# EAGLE design dev style cell rev0.1 (EAGLE 8.4.3)

## Sheet 1 of 3
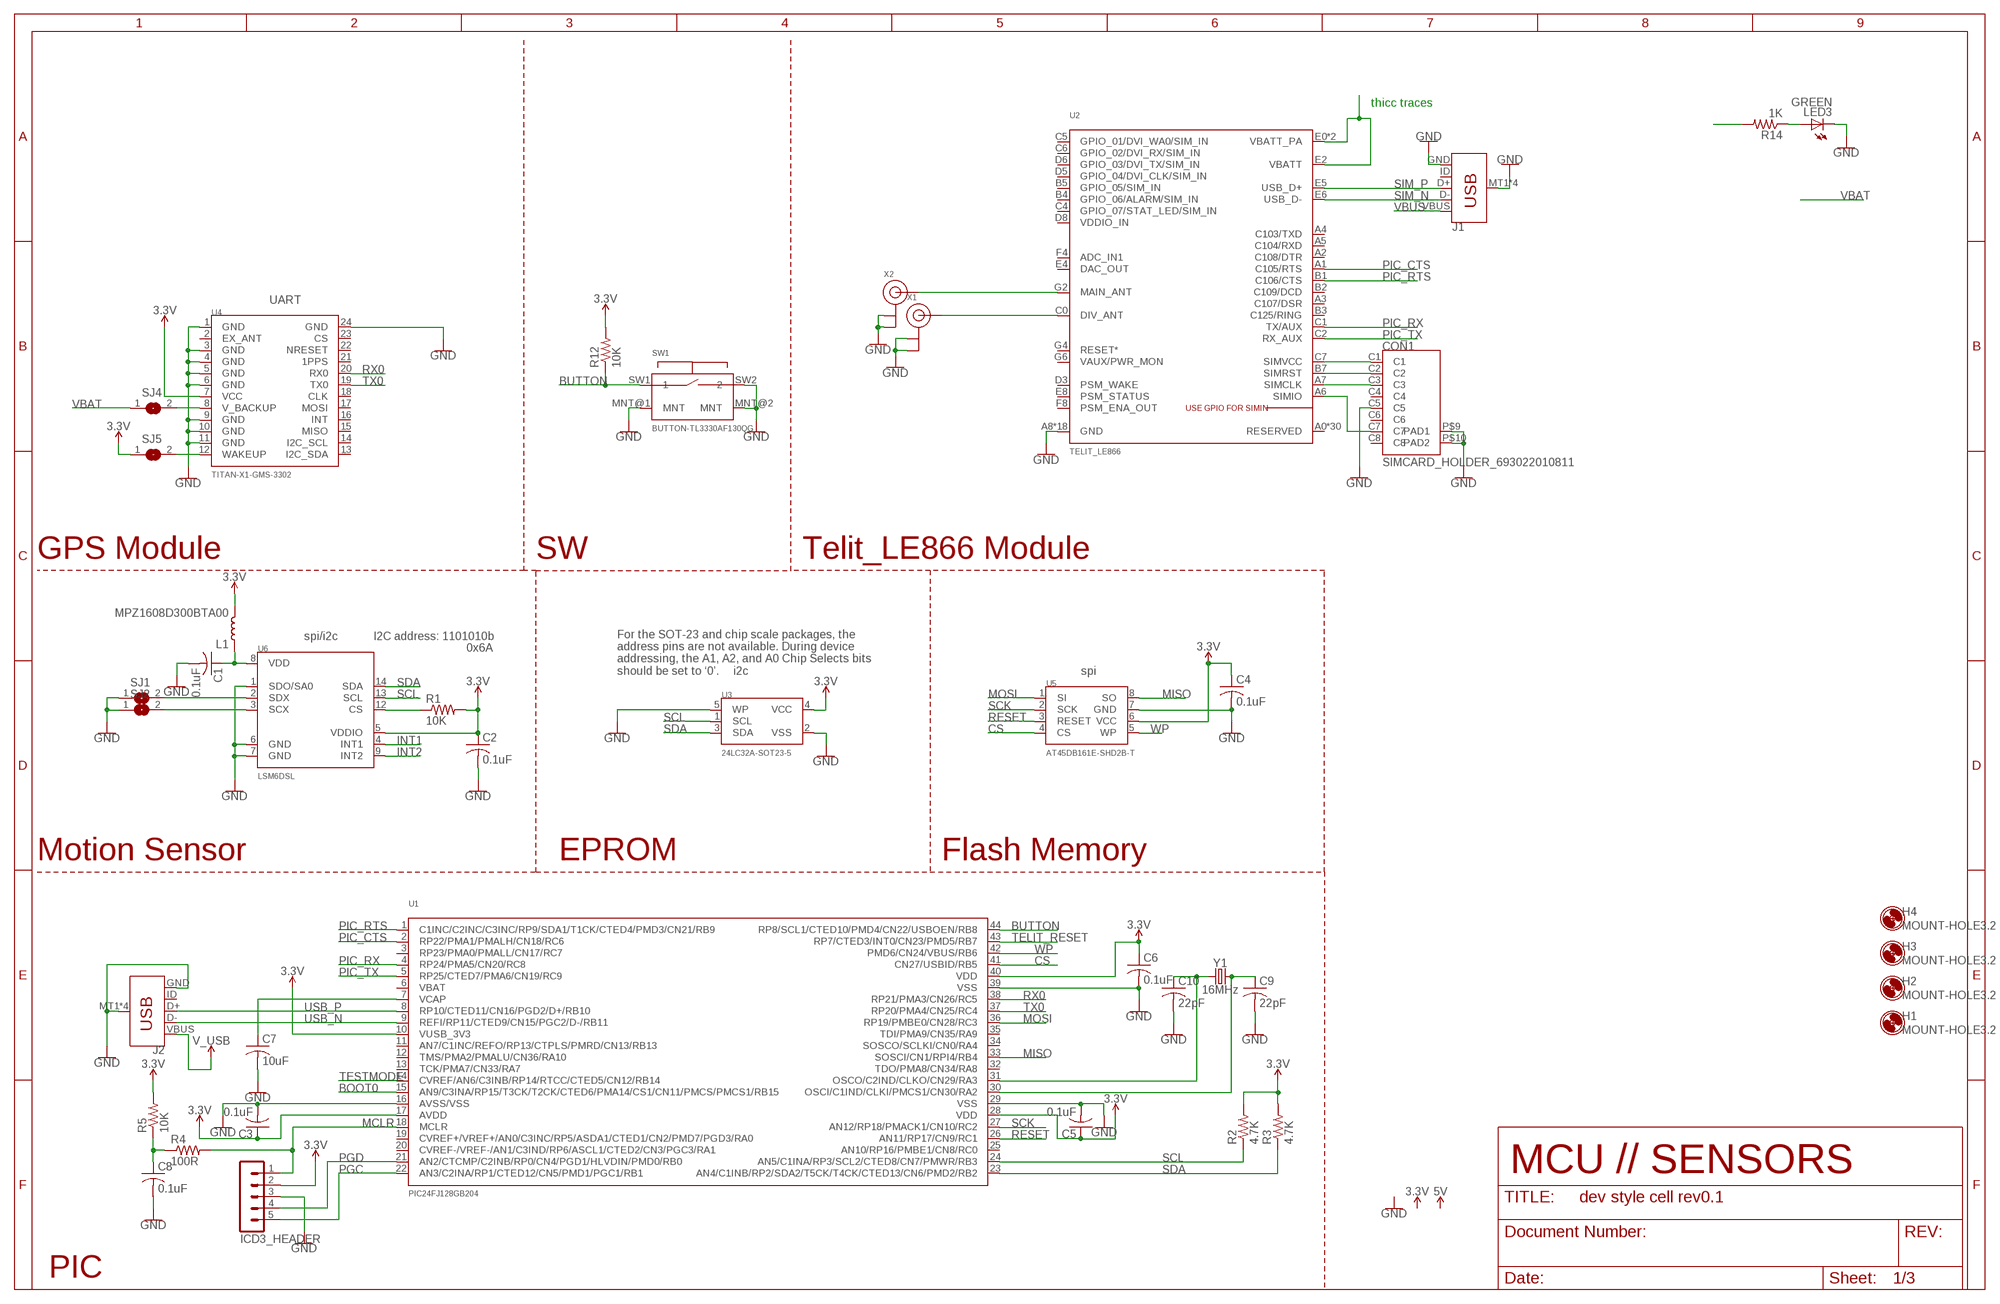
[diagram p0: schematic, sheet 1, part 1 of 2]
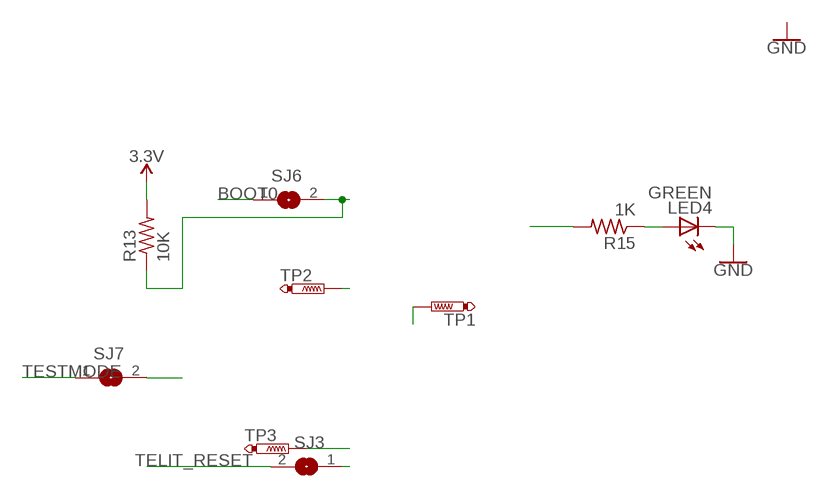
[diagram p1: schematic, sheet 1, part 2 of 2]

### Parts
C1  0.1uF  C-USC0402  [C0402]
C2  0.1uF  C-USC0402  [C0402]
C3  0.1uF  C-USC0402  [C0402]
C4  0.1uF  C-USC0402  [C0402]
C5  0.1uF  C-USC0402  [C0402]
C6  0.1uF  C-USC0402  [C0402]
C7  10uF  C-USC0603  [C0603]
C8  0.1uF  C-USC0402  [C0402]
C9  22pF  C-USC0402  [C0402]
C10  22pF  C-USC0402  [C0402]
CON1  SIMCARD_HOLDER_693022010811  [SIMCARD_HOLDER_693022010811]
H1  MOUNT-HOLE3.2  [3,2]
H2  MOUNT-HOLE3.2  [3,2]
H3  MOUNT-HOLE3.2  [3,2]
H4  MOUNT-HOLE3.2  [3,2]
ICD3_HEADER  MA05-1  [MA05-1]
J1  USB_MICRO-B_SMT  [USB-MICROB]
J2  USB_MICRO-B_SMT  [USB-MICROB]
L1  MPZ1608D300BTA00  INDUCTOR-0402-3.9NH  [0402]
LED3  GREEN  LEDCHIP-LED0603  [CHIP-LED0603]
LED4  GREEN  LEDCHIP-LED0603  [CHIP-LED0603]
R1  10K  R-US_R0402  [R0402]
R2  4.7K  R-US_R0402  [R0402]
R3  4.7K  R-US_R0402  [R0402]
R4  100R  R-US_R0402  [R0402]
R5  10K  R-US_R0402  [R0402]
R12  10K  R-US_R0402  [R0402]
R13  10K  R-US_R0402  [R0402]
R14  1K  R-US_R0402  [R0402]
R15  1K  R-US_R0402  [R0402]
SJ1  SJ  [SJ]
SJ2  SJ  [SJ]
SJ3  SJ  [SJ]
SJ4  SJ  [SJ]
SJ5  SJ  [SJ]
SJ6  SJ  [SJ]
SJ7  SJ  [SJ]
SW1  BUTTON-TL3330AF130QG  [BUTTON-TL3330AF130QG]
TP1  PTR1PAD1-17  [P1-17]
TP2  PTR1PAD1-17  [P1-17]
TP3  PTR1PAD1-17  [P1-17]
U1  PIC24FJ128GB204  [PIC24FJ128GB204]
U2  TELIT_LE866  [TELIT_LE866]
U3  24LC32A-SOT23-5  [24LC32A-SOT23-5]
U4  TITAN-X1-GMS-3302  [TITAN-X1-GMS-3302]
U5  AT45DB161E-SHD2B-T  [AT45DB161E-SHD2B-T]
U6  LSM6DSL  [LSM6DSL]
U$1  FIDUCIAL  [FIDUCIAL_1MM]
U$2  FIDUCIAL  [FIDUCIAL_1MM]
U$3  FIDUCIAL  [FIDUCIAL_1MM]
U$4  FIDUCIAL  [FIDUCIAL_1MM]
X1  ANTENNA_U.FL  [U.FL]
X2  ANTENNA_U.FL  [U.FL]
Y1  16MHz  CRYSTAL-16MHZSMD-5X3.2  [CRYSTAL-SMD-5X3.2-4PAD]

### Nets
3.3V: C2.1 C3.1 C4.1 C5.1 C6.1 ICD3_HEADER.2 L1.2 R1.2 R2.2 R3.2 R5.2 R12.2 R13.2 SJ5.1 U1.10(VUSB_3V3) U1.17(AVDD) U1.28(VDD) U1.40(VDD) U3.4(VCC) U4.7(VCC) U5.6(VCC) U6.5(VDDIO) ; also sheet 2
BOOT0: SJ6.1 U1.15(AN9/C3INA/RP15/T3CK/T2CK/CTED6/PMA14/CS1/CN11/PMCS/PMCS1/RB15)
BUTTON: R12.1 SW1.SW1 U1.44(RP8/SCL1/CTED10/PMD4/CN22/USBOEN/RB8)
CS: U1.41(CN27/USBID/RB5) U5.4(CS)
DIV_ANT: U2.C0(DIV_ANT)
GND: C1.2 C2.2 C3.2 C4.2 C5.2 C6.2 C7.2 C8.2 C9.2 C10.2 CON1.C5 CON1.P$9(PAD1) CON1.P$10(PAD2) ICD3_HEADER.3 J1.GND J1.MT1(SHIELD) J1.MT2(SHIELD) J1.P$1(SHIELD) J1.P$2(SHIELD) J2.GND J2.MT1(SHIELD) J2.MT2(SHIELD) J2.P$1(SHIELD) J2.P$2(SHIELD) LED3.C LED4.C SJ1.1 SJ2.1 SW1.MNT@1(MNT) SW1.MNT@2(MNT) SW1.SW2 U1.16(AVSS/VSS) U1.29(VSS) U1.39(VSS) U2.A8(GND) U2.A11(GND) U2.B0(GND) U2.C3(GND) U2.D0(GND) U2.D1(GND) U2.D2(GND) U2.E3(GND) U2.F0(GND) U2.F1(GND) U2.F2(GND) U2.F3(GND) U2.F6(GND) U2.G0(GND) U2.G1(GND) U2.G3(GND) U2.G8(GND) U2.G11(GND) U3.2(VSS) U3.5(WP) U4.1(GND) U4.3(GND) U4.4(GND) U4.5(GND) U4.6(GND) U4.9(GND) U4.10(GND) U4.11(GND) U4.24(GND) U5.7(GND) U6.1(SDO/SA0) U6.6(GND) U6.7(GND) X1.1(GND) X1.2(GND) X2.1(GND) X2.2(GND) ; also sheet 2
INT1: U6.4(INT1)
INT2: U6.9(INT2)
MAIN_ANT: U2.G2(MAIN_ANT) X2.3(SIGNAL)
MCLR: ICD3_HEADER.1 R4.2 U1.18(MCLR)
MISO: U1.33(SOSCI/CN1/RPI4/RB4) U5.8(SO)
MOSI: U1.36(RP19/PMBE0/CN28/RC3) U5.1(SI)
N$1: SJ1.2 U6.2(SDX)
N$2: SJ2.2 U6.3(SCX)
N$3: R1.1 U6.12(CS)
N$4: SJ4.2 U4.8(V_BACKUP)
N$5: C1.1 L1.1 U6.8(VDD)
N$6: C8.1 R4.1 R5.1
N$7: C9.1 U1.30(OSCI/C1IND/CLKI/PMCS1/CN30/RA2) Y1.3
N$8: C10.1 U1.31(OSCO/C2IND/CLKO/CN29/RA3) Y1.1
N$9: C7.1 U1.7(VCAP)
N$11: SJ7.2
N$12: U2.E0(VBATT_PA) U2.E1(VBATT_PA) U2.E2(VBATT)
N$18: R14.2
N$21: X1.3(SIGNAL)
N$22: R13.1 SJ6.2
N$23: CON1.C1 U2.C7(SIMVCC)
N$25: CON1.C2 U2.B7(SIMRST)
N$26: CON1.C3 U2.A7(SIMCLK)
N$27: CON1.C7 U2.A6(SIMIO)
N$28: LED3.A R14.1
N$30: LED4.A R15.1
N$31: R15.2
N$36: TP3.TP
N$42: SJ3.1
N$47: TP1.TP
N$48: TP2.TP
PGC: ICD3_HEADER.5 U1.22(AN3/C2INA/RP1/CTED12/CN5/PMD1/PGC1/RB1)
PGD: ICD3_HEADER.4 U1.21(AN2/CTCMP/C2INB/RP0/CN4/PGD1/HLVDIN/PMD0/RB0)
PIC_CTS: U1.2(RP22/PMA1/PMALH/CN18/RC6) U2.A1(C105/RTS)
PIC_RTS: U1.1(C1INC/C2INC/C3INC/RP9/SDA1/T1CK/CTED4/PMD3/CN21/RB9) U2.B1(C106/CTS)
PIC_RX: U1.4(RP24/PMA5/CN20/RC8) U2.C1(TX/AUX)
PIC_TX: U1.5(RP25/CTED7/PMA6/CN19/RC9) U2.C2(RX_AUX)
RESET: U1.26(AN11/RP17/CN9/RC1) U5.3(RESET)
RX0: U1.38(RP21/PMA3/CN26/RC5) U4.20(RX0)
SCK: U1.27(AN12/RP18/PMACK1/CN10/RC2) U5.2(SCK)
SCL: R2.1 U1.24(AN5/C1INA/RP3/SCL2/CTED8/CN7/PMWR/RB3) U3.1(SCL) U6.13(SCL)
SDA: R3.1 U1.23(AN4/C1INB/RP2/SDA2/T5CK/T4CK/CTED13/CN6/PMD2/RB2) U3.3(SDA) U6.14(SDA)
SIM_N: J1.D- U2.E6(USB_D-)
SIM_P: J1.D+ U2.E5(USB_D+)
TELIT_RESET: SJ3.2 U1.43(RP7/CTED3/INT0/CN23/PMD5/RB7)
TELIT_WAKEUP: SJ5.2 U4.12(WAKEUP)
TESTMODE: SJ7.1 U1.14(CVREF/AN6/C3INB/RP14/RTCC/CTED5/CN12/RB14)
TX0: U1.37(RP20/PMA4/CN25/RC4) U4.19(TX0)
USB_N: J2.D- U1.9(REFI/RP11/CTED9/CN15/PGC2/D-/RB11)
USB_P: J2.D+ U1.8(RP10/CTED11/CN16/PGD2/D+/RB10)
V_USB: J2.VBUS ; also sheet 2
VBAT: SJ4.1 ; also sheet 2
VBUS: J1.VBUS
WP: U1.42(PMD6/CN24/VBUS/RB6) U5.5(WP)
Unconnected: CON1.C4 CON1.C6 CON1.C8 J1.ID J2.ID U1.3(RP23/PMA0/PMALL/CN17/RC7) U1.6(VBAT) U1.11(AN7/C1INC/REFO/RP13/CTPLS/PMRD/CN13/RB13) U1.12(TMS/PMA2/PMALU/CN36/RA10) U1.13(TCK/PMA7/CN33/RA7) U1.19(CVREF+/VREF+/AN0/C3INC/RP5/ASDA1/CTED1/CN2/PMD7/PGD3/RA0) U1.20(CVREF-/VREF-/AN1/C3IND/RP6/ASCL1/CTED2/CN3/PGC3/RA1) U1.25(AN10/RP16/PMBE1/CN8/RC0) U1.32(TDO/PMA8/CN34/RA8) U1.34(SOSCO/SCLKI/CN0/RA4) U1.35(TDI/PMA9/CN35/RA9) U2.A0(RESERVED) U2.A2(C108/DTR) U2.A3(C107/DSR) U2.A4(C103/TXD) U2.A5(C104/RXD) U2.A9(RESERVED) U2.A10(RESERVED) U2.B2(C109/DCD) U2.B3(C125/RING) U2.B4(GPIO_06/ALARM/SIM_IN) U2.B5(GPIO_05/SIM_IN) U2.B6(RESERVED) U2.B8(RESERVED) U2.B9(RESERVED) U2.B10(RESERVED) U2.B11(RESERVED) U2.C4(GPIO_07/STAT_LED/SIM_IN) U2.C5(GPIO_01/DVI_WA0/SIM_IN) U2.C6(GPIO_02/DVI_RX/SIM_IN) U2.C8(RESERVED) U2.C9(RESERVED) U2.C10(RESERVED) U2.C11(RESERVED) U2.D3(PSM_WAKE) U2.D4(RESERVED) U2.D5(GPIO_04/DVI_CLK/SIM_IN) U2.D6(GPIO_03/DVI_TX/SIM_IN) U2.D7(RESERVED) U2.D8(VDDIO_IN) U2.D9(RESERVED) U2.D10(RESERVED) U2.D11(RESERVED) U2.E4(DAC_OUT) U2.E7(RESERVED) U2.E8(PSM_STATUS) U2.E9(RESERVED) U2.E10(RESERVED) U2.E11(RESERVED) U2.F4(ADC_IN1) U2.F5(RESERVED) U2.F7(RESERVED) U2.F8(PSM_ENA_OUT) U2.F9(RESERVED) U2.F10(RESERVED) U2.F11(RESERVED) U2.G4(RESET*) U2.G5(RESERVED) U2.G6(VAUX/PWR_MON) U2.G7(RESERVED) U2.G9(RESERVED) U2.G10(RESERVED) U4.2(EX_ANT) U4.13(I2C_SDA) U4.14(I2C_SCL) U4.15(MISO) U4.16(INT) U4.17(MOSI) U4.18(CLK) U4.21(1PPS) U4.22(NRESET) U4.23(CS)

### Notes on the sheet
- thicc traces
- UART
- GPS Module | SW | Telit_LE866 Module
- spi/i2c | I2C address: 1101010b
- 0x6A
- For the SOT-23 and chip scale packages, the
  address pins are not available. During device
  addressing, the A1, A2, and A0 Chip Selects bits
  should be set to ‘0’.
- i2c | spi
- Motion Sensor | EPROM | Flash Memory
- MCU // SENSORS
- PIC

## Sheet 2 of 3
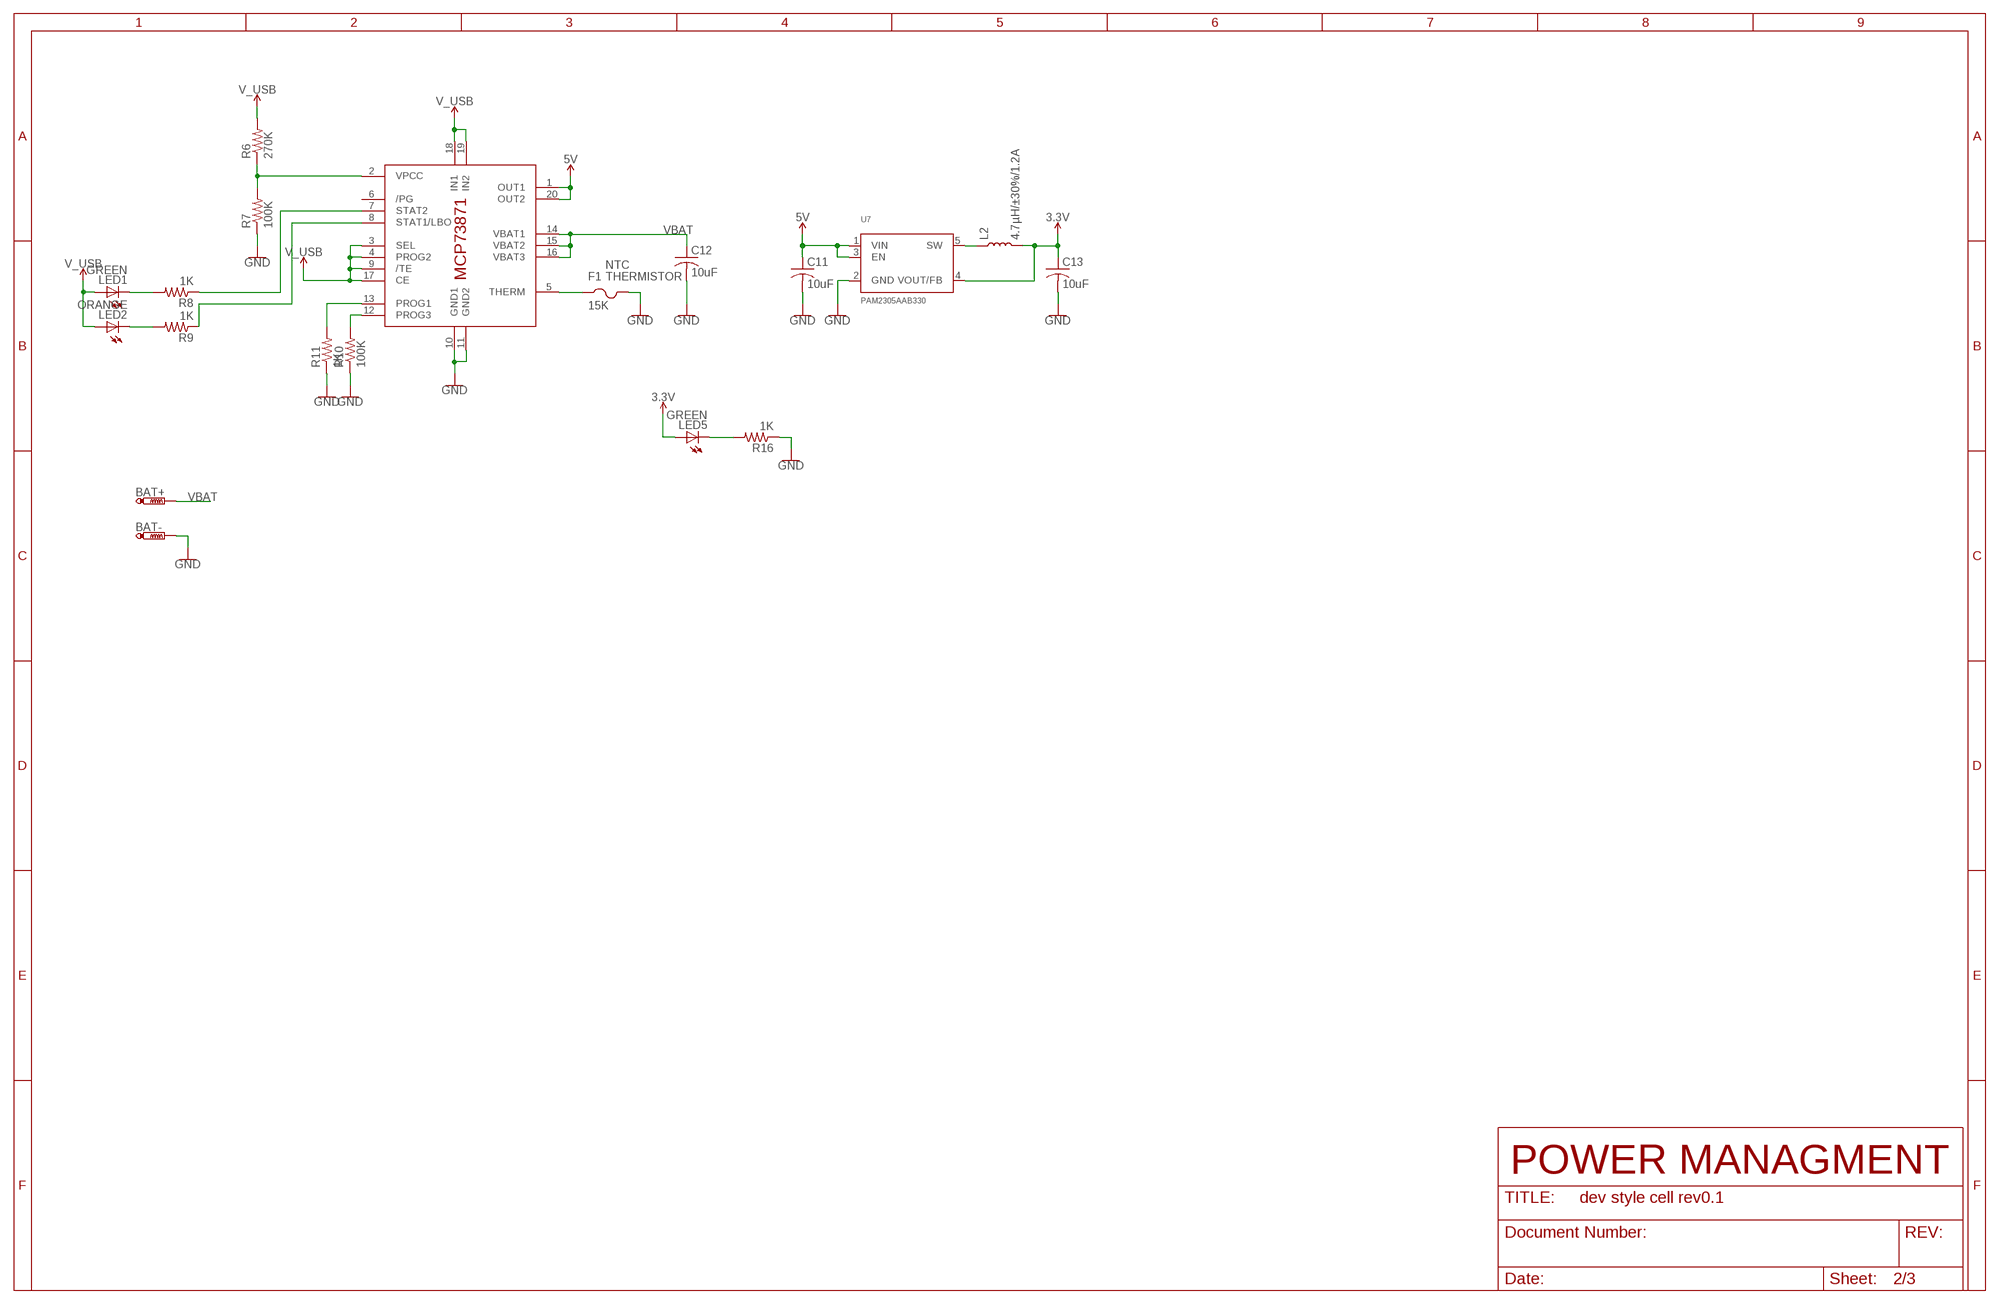
[diagram p2: schematic, sheet 2]

### Parts
BAT+  PTR1B2,54  [B2,54]
BAT-  PTR1B2,54  [B2,54]
C11  10uF  C-USC0805  [C0805]
C12  10uF  C-USC0603  [C0603]
C13  10uF  C-USC0805  [C0805]
F1  15K  PTCFUSE-1206  [R1206]
L2  4.7µH/±30%/1.2A  INDUCTOR-CDRH-4.7UH  [INDUCTOR_4.7UH]
LED1  GREEN  LEDCHIP-LED0603  [CHIP-LED0603]
LED2  ORANGE  LEDCHIP-LED0603  [CHIP-LED0603]
LED5  GREEN  LEDCHIP-LED0603  [CHIP-LED0603]
R6  270K  R-US_R0402  [R0402]
R7  100K  R-US_R0402  [R0402]
R8  1K  R-US_R0402  [R0402]
R9  1K  R-US_R0402  [R0402]
R10  100K  R-US_R0402  [R0402]
R11  1K  R-US_R0402  [R0402]
R16  1K  R-US_R0402  [R0402]
U7  PAM2305AAB330  [PAM2305AAB330]
U8  MCP73871  [QFN20]

### Nets
3.3V: C13.1 L2.P$2 LED5.A U7.4(VOUT/FB) ; also sheet 1
5V: C11.1 U7.1(VIN) U7.3(EN) U8.1(OUT1) U8.20(OUT2)
GND: BAT-.TP C11.2 C12.2 C13.2 F1.2 R7.1 R10.1 R11.1 R16.1 U7.2(GND) U8.10(GND1) U8.11(GND2) ; also sheet 1
N$10: R6.1 R7.2 U8.2(VPCC)
N$13: LED1.C R8.2
N$14: LED2.C R9.2
N$15: R8.1 U8.7(STAT2)
N$16: R9.1 U8.8(STAT1/LBO)
N$17: L2.P$1 U7.5(SW)
N$19: R10.2 U8.12(PROG3)
N$20: R11.2 U8.13(PROG1)
N$24: F1.1 U8.5(THERM)
N$35: LED5.C R16.2
V_USB: LED1.A LED2.A R6.2 U8.3(SEL) U8.4(PROG2) U8.9(/TE) U8.17(CE) U8.18(IN1) U8.19(IN2) ; also sheet 1
VBAT: BAT+.TP C12.1 U8.14(VBAT1) U8.15(VBAT2) U8.16(VBAT3) ; also sheet 1
Unconnected: U8.6(/PG)

### Notes on the sheet
- NTC
- THERMISTOR
- POWER MANAGMENT

## Sheet 3 of 3
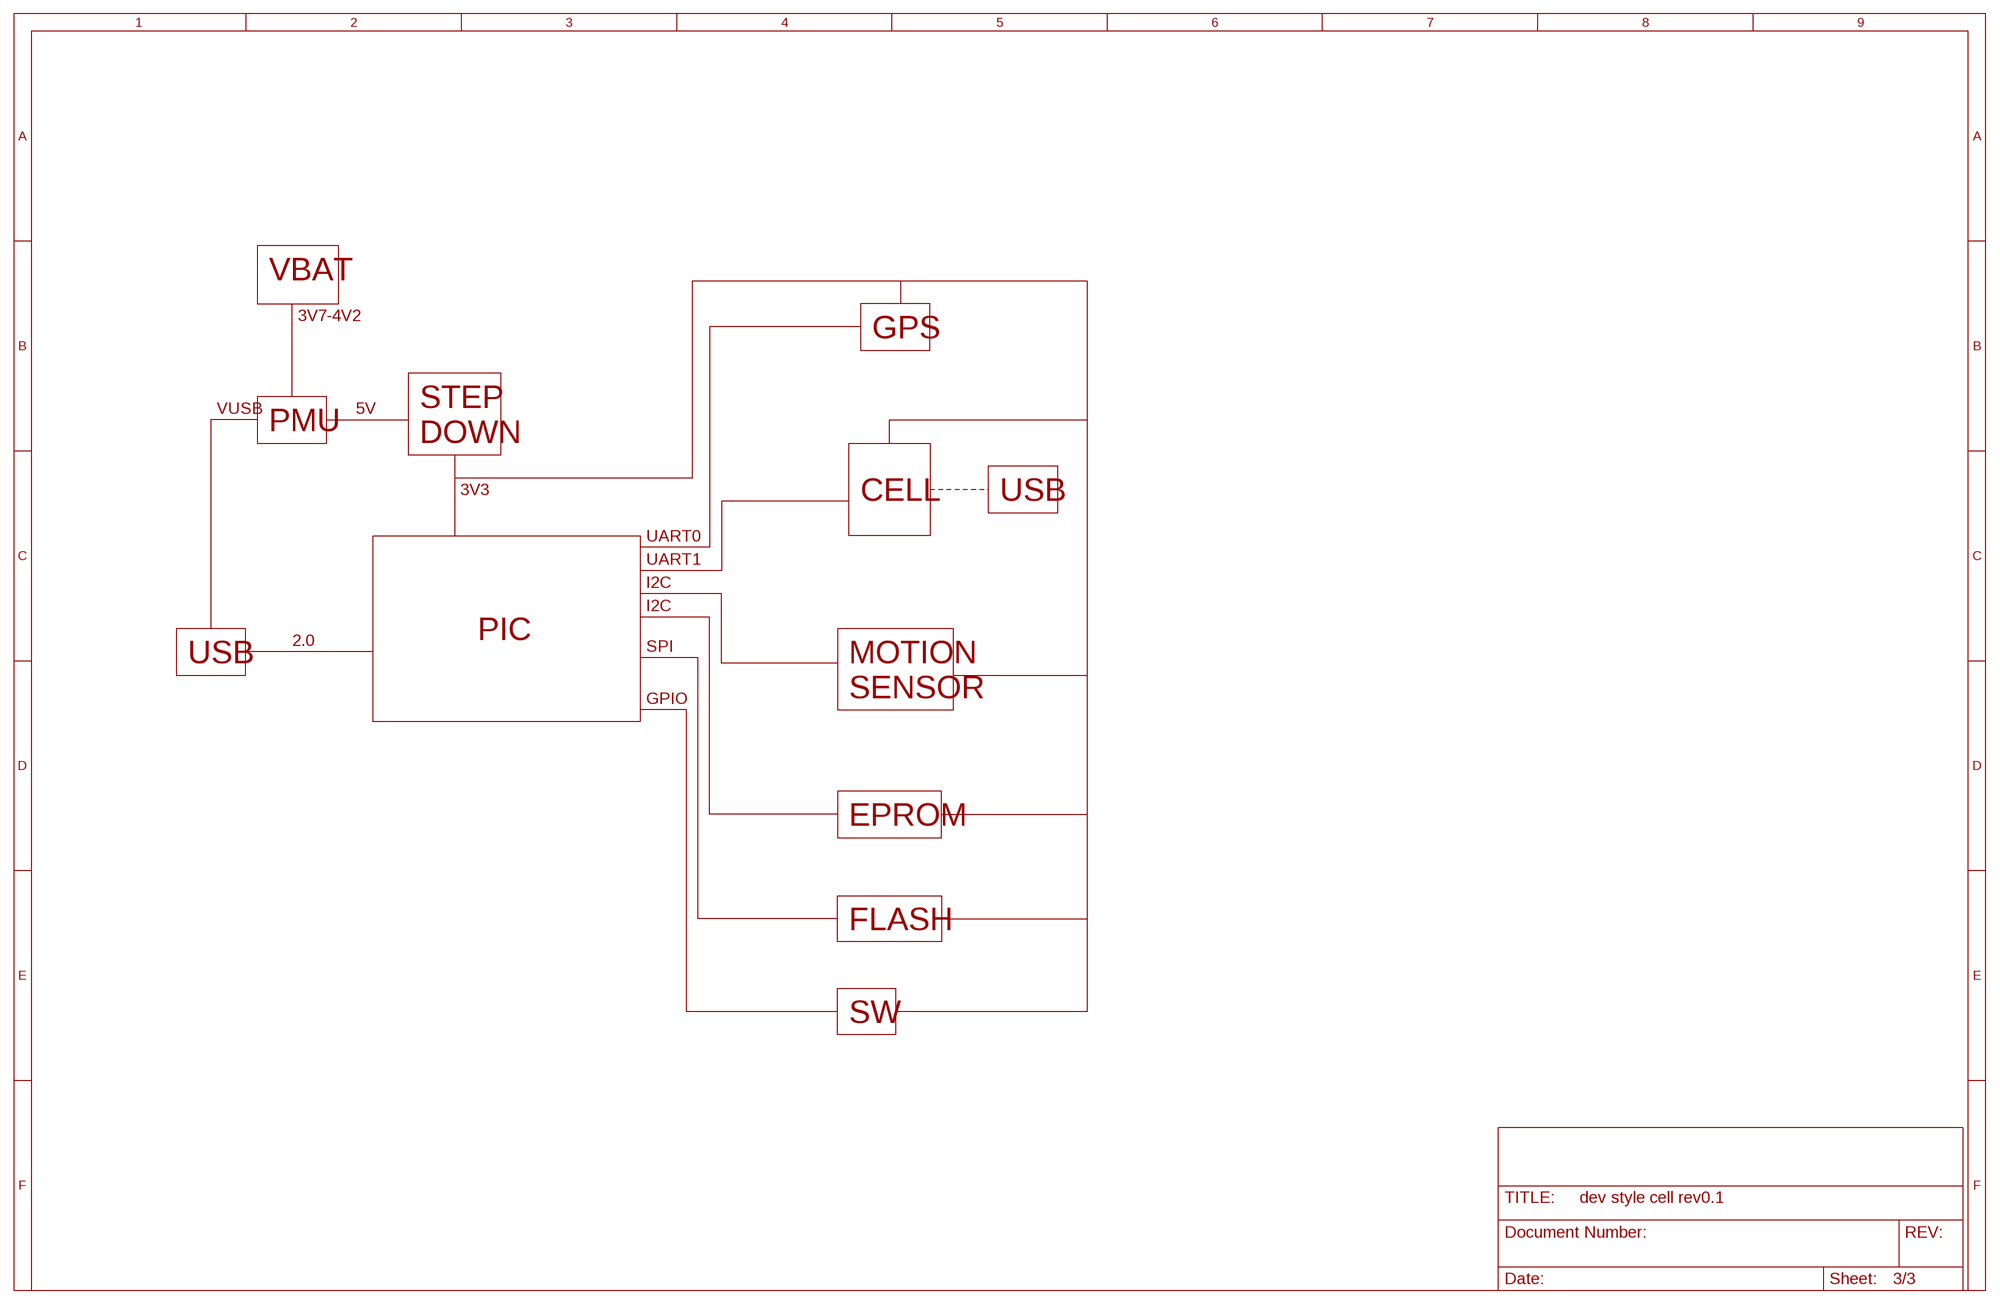
[diagram p3: schematic, sheet 3]

### Notes on the sheet
- VBAT
- 3V7-4V2
- GPS
- VUSB | 5V
- PMU
- STEP
  DOWN
- 3V3
- CELL | USB
- UART0
- UART1
- I2C
- I2C
- PIC
- 2.0
- SPI
- USB
- MOTION 
  SENSOR
- GPIO
- EPROM
- FLASH
- SW

## Library data of the parts
BAT+ BAT- TP1-TP3 = testpad:PTR1: TEST PIN
C1-C13 = resistor:C-US: CAPACITOR, American symbol
CON1 = clackboard_lib:SIMCARD_HOLDER_693022010811
F1 = adafruit:PTCFUSE: PTC fuses, resettable thermistors
H1-H4 = holes:MOUNT-HOLE: MOUNTING HOLE with drill center marker
ICD3_HEADER = con-lstb:MA05-1: PIN HEADER; OC_FARNELL: unknown; OC_NEWARK: unknown
J1 J2 = SparkFun-Connectors:USB_MICRO-B: USB Type Micro-B Connector Male/female and PTH/SMT variants SparkFun Products: SparkFun microB USB Breakout <https://www.sparkfun.com/products/12035> SparkFun USB microB Plug Breakout <https://www.sparkfun.com/products/10031> SparkFun ESP8266 Thing <https://www.sparkfun.com/products/13231>; PROD_ID: CONN-09505; SF_ID: PRT-08533
L1 = SparkFun-Coils:INDUCTOR: Inductors Resist changes in electrical current. Basically a coil of wire. SparkFun Products: SparkFun Load Cell Amplifier - HX711 <https://www.sparkfun.com/products/13879> IOIO-OTG - V2.2 <https://www.sparkfun.com/products/13613>; PROD_ID: NDUC-13457; VALUE: 3.9NH
L2 = SparkFun-Coils:INDUCTOR: Inductors Resist changes in electrical current. Basically a coil of wire. SparkFun Products: SparkFun Load Cell Amplifier - HX711 <https://www.sparkfun.com/products/13879> IOIO-OTG - V2.2 <https://www.sparkfun.com/products/13613>; PROD_ID: NDUC-10146
LED1-LED5 = adafruit:LED: LED OSRAM: - CHIPLED LG R971, LG N971, LY N971, LG Q971, LY Q971, LO R971, LY R971 LH N974, LH R974 LS Q976, LO Q976, LY Q976 LO Q996 - Hyper CHIPLED LW Q18S LB Q993, LB Q99A, LB R99A - SideLED LS A670, LO A670, LY A670, LG A670, LP A670 LB A673, LV A673, LT A673, LW A673 LH A674 LY A675 LS A676, LA A676, LO A676, LY A676, LW A676 LS A679, LY A679, LG A679 - Hyper Micro SIDELED® LS Y876, LA Y876, LO Y876, LY Y876 LT Y87S - SmartLED LW L88C, LW L88S LB L89C, LB L89S, LG L890 LS L89K, LO L89K, LY L89K LS L896, LA L896, LO L896, LY L896 - TOPLED LS T670, LO T670, LY T670, LG T670, LP T670 LSG T670, LSP T670, LSY T670, LOP T670, LYG T670 LG T671, LOG T671, LSG T671 LB T673, LV T673, LT T673, LW T673 LH T674 LS T676, LA T676, LO T676, LY T676, LB T676, LH T676, LSB T676, LW T676 LB T67C, LV T67C, LT T67C, LS T67K, LO T67K, LY T67K, LW E67C LS E67B, LA E67B, LO E67B, LY E67B, LB E67C, LV E67C, LT E67C LW T67C LS T679, LY T679, LG T679 LS T770, LO T770, LY T770, LG T770, LP T770 LB T773, LV T773, LT T773, LW T773 LH T774 LS E675, LA E675, LY E675, LS T675 LS T776, LA T776, LO T776, LY T776, LB T776 LHGB T686 LT T68C, LB T68C - Hyper Mini TOPLED® LB M676 - Mini TOPLED Santana® LG M470 LS M47K, LO M47K, LY M47K Source: http://www.osram.convergy.de/
R1-R16 = resistor:R-US_: RESISTOR, American symbol
SJ1-SJ7 = jumper:SJ: SMD solder JUMPER
SW1 = clackboard_lib:BUTTON-TL3330AF130QG
U1 = clackboard_lib:PIC24FJ128GB204
U2 = clackboard_lib:TELIT_LE866
U3 = clackboard_lib:24LC32A-SOT23-5
U4 = clackboard_lib:TITAN-X1-GMS-3302
U5 = clackboard_lib:AT45DB161E-SHD2B-T
U6 = clackboard_lib:LSM6DSL; SPICEPREFIX: X
U7 = clackboard_lib:PAM2305AAB330
U8 = adafruit:MCP73871
U$1-U$4 = adafruit:FIDUCIAL: For use by pick and place machines to calibrate the vision/machine, 1mm By microbuilder.eu
X1 X2 = adafruit:ANTENNA_U.FL: U.FL Antenna Connector
Y1 = SparkFun-Clocks:CRYSTAL-16MHZ: 16MHz Crystal Digikey Example <http://www.digikey.com/product-search/en?keywords=535-9122-1-ND> Frequency: 16MHz Frequency Stability: ±50ppm Frequency Tolerance: ±20ppm Load Capacitance: 18pF SparkFun Products: Pro Micro -5V/16MHz <https://www.sparkfun.com/products/12640> SparkFun Serial Enabled LCD Kit <https://www.sparkfun.com/products/10097>; PROD_ID: XTAL-08218; SF_ID: COM-00094

## Board
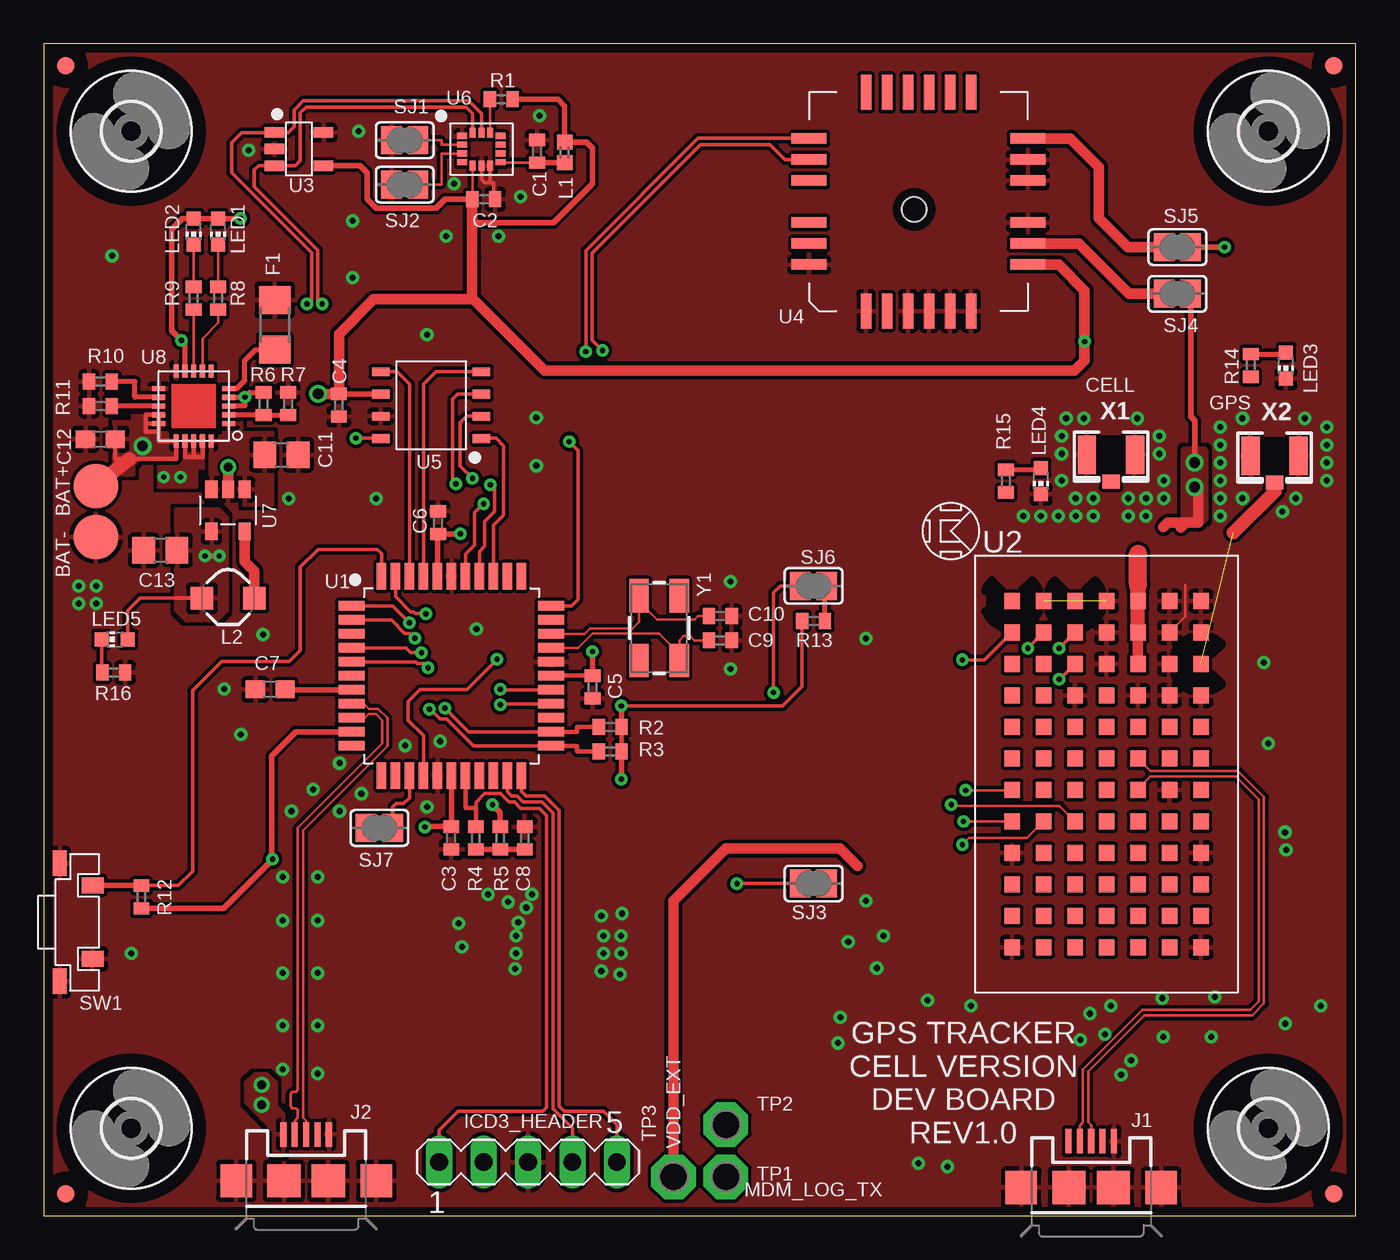
[diagram p4: board, top side]
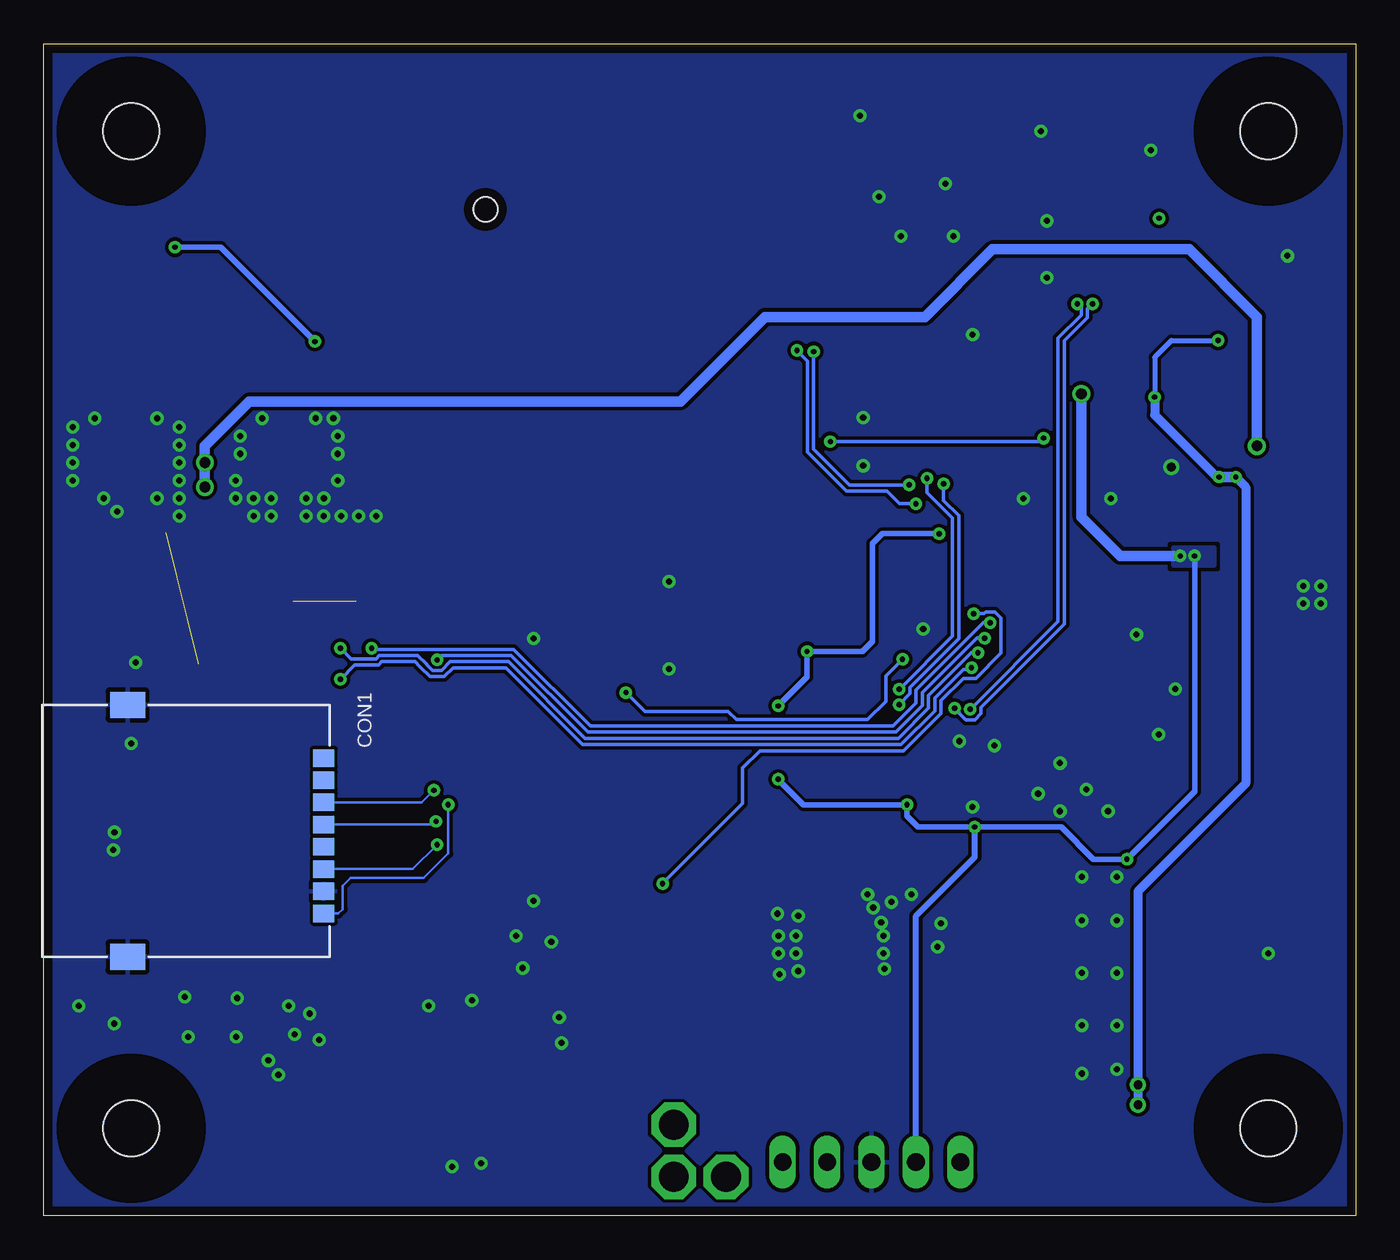
[diagram p5: board, bottom side, seen from below]

Size 75 x 67 mm. Coordinates in mm from the lower left corner, seen from the top.
Outline: 0,0 75,0 75,67 0,67 0,0
Copper layers (1*16): Top 0.035mm / dielectric 1.5mm / Bottom 0.035mm
Design rules "default *": minimum track width 6mil, minimum drill 0.3mm, track to track 6mil, track to pad 6mil, pad to pad 6mil, via to via 6mil, smd to smd 6mil, copper to edge 20mil, drill to drill 6mil, minimum pad ring 10mil, minimum via ring 8mil, stop-mask expansion 4mil, vias tented up to drill 0.35mm, thermal gap 10mil

### Footprints (pad centres in the part's own frame; a part is rotated, then mirrored left to right if it is on the bottom)
B2,54 = smd 2.54 x 2.54: TP 0,0
C0402 = smd 0.7 x 0.9: 1 -0.65,0; 2 0.65,0
C0603 = smd 1.1 x 1: 1 -0.85,0; 2 0.85,0
C0805 = smd 1.3 x 1.5: 1 -0.95,0; 2 0.95,0
SIMCARD_HOLDER_693022010811 = smd 1 x 1.2: C1 -4.72,0; C2 -2.18,0; C3 0.36,0; C4 2.9,0; C5 -3.45,0; C6 -0.91,0; C7 1.63,0; C8 4.17,0 | smd 1.5 x 2: P$9 -7.2,11.2; P$10 7.2,11.2
R1206 = smd 1.6 x 1.803: 1 -1.422,0; 2 1.422,0
3,2 = hole 3.2: 0,0
MA05-1 = drill 1.016 long: 1 -5.08,0; 2 -2.54,0; 3 0,0; 4 2.54,0; 5 5.08,0
USB-MICROB = smd 1.4 x 0.35: D+ -2.65,0; D- -2.65,-0.65; GND -2.65,1.3; ID -2.65,0.65; VBUS -2.65,-1.3 | smd 1.9 x 1.8: MT1 0,-4; MT2 0,4 | smd 1.9 x 1.9: P$1 0,-1.27; P$2 0,1.27
0402 = smd 0.85 x 0.9: 1 -0.58,0; 2 0.58,0
INDUCTOR_4.7UH = smd 1.3 x 1.3: P$1 -1.5,0; P$2 1.5,0
CHIP-LED0603 = smd 0.8 x 0.8: A 0,-0.75; C 0,0.75
R0402 = smd 0.7 x 0.9: 1 -0.65,0; 2 0.65,0
SJ = smd 1.168 x 1.6: 1 -0.762,0; 2 0.762,0
BUTTON-TL3330AF130QG = smd 1.45 x 0.8: MNT@1 -3.375,-1; MNT@2 3.375,-1 | smd 0.9 x 1.27: SW1 -2.1,0.885; SW2 2.1,0.885
P1-17 = drill 1.702 pad 2.54 octagon: TP 0,0
PIC24FJ128GB204 = smd 1.5 x 0.55: 1 -5.7,4; 2 -5.7,3.2; 3 -5.7,2.4; 4 -5.7,1.6; 5 -5.7,0.8; 6 -5.7,0; 7 -5.7,-0.8; 8 -5.7,-1.6; 9 -5.7,-2.4; 10 -5.7,-3.2; 11 -5.7,-4; 23 5.7,-4; 24 5.7,-3.2; 25 5.7,-2.4; 26 5.7,-1.6; 27 5.7,-0.8; 28 5.7,0; 29 5.7,0.8; 30 5.7,1.6; 31 5.7,2.4; 32 5.7,3.2; 33 5.7,4 | smd 0.55 x 1.5: 12 -4,-5.7; 13 -3.2,-5.7; 14 -2.4,-5.7; 15 -1.6,-5.7; 16 -0.8,-5.7; 17 0,-5.7; 18 0.8,-5.7; 19 1.6,-5.7; 20 2.4,-5.7; 21 3.2,-5.7; 22 4,-5.7; 34 4,5.7; 35 3.2,5.7; 36 2.4,5.7; 37 1.6,5.7; 38 0.8,5.7; 39 0,5.7; 40 -0.8,5.7; 41 -1.6,5.7; 42 -2.4,5.7; 43 -3.2,5.7; 44 -4,5.7
TELIT_LE866 = smd 0.9 x 0.9: A0 -5.4,9.9; A1 -5.4,8.1; A2 -5.4,6.3; A3 -5.4,4.5; A4 -5.4,2.7; A5 -5.4,0.9; A6 -5.4,-0.9; A7 -5.4,-2.7; A8 -5.4,-4.5; A9 -5.4,-6.3; A10 -5.4,-8.1; A11 -5.4,-9.9; B0 -3.6,9.9; B1 -3.6,8.1; B2 -3.6,6.3; B3 -3.6,4.5; B4 -3.6,2.7; B5 -3.6,0.9; B6 -3.6,-0.9; B7 -3.6,-2.7; B8 -3.6,-4.5; B9 -3.6,-6.3; B10 -3.6,-8.1; B11 -3.6,-9.9; C0 -1.8,9.9; C1 -1.8,8.1; C2 -1.8,6.3; C3 -1.8,4.5; C4 -1.8,2.7; C5 -1.8,0.9; C6 -1.8,-0.9; C7 -1.8,-2.7; C8 -1.8,-4.5; C9 -1.8,-6.3; C10 -1.8,-8.1; C11 -1.8,-9.9; D0 0,9.9; D1 0,8.1; D2 0,6.3; D3 0,4.5; D4 0,2.7; D5 0,0.9; D6 0,-0.9; D7 0,-2.7; D8 0,-4.5; D9 0,-6.3; D10 0,-8.1; D11 0,-9.9; E0 1.8,9.9; E1 1.8,8.1; E2 1.8,6.3; E3 1.8,4.5; E4 1.8,2.7; E5 1.8,0.9; E6 1.8,-0.9; E7 1.8,-2.7; E8 1.8,-4.5; E9 1.8,-6.3; E10 1.8,-8.1; E11 1.8,-9.9; F0 3.6,9.9; F1 3.6,8.1; F2 3.6,6.3; F3 3.6,4.5; F4 3.6,2.7; F5 3.6,0.9; F6 3.6,-0.9; F7 3.6,-2.7; F8 3.6,-4.5; F9 3.6,-6.3; F10 3.6,-8.1; F11 3.6,-9.9; G0 5.4,9.9; G1 5.4,8.1; G2 5.4,6.3; G3 5.4,4.5; G4 5.4,2.7; G5 5.4,0.9; G6 5.4,-0.9; G7 5.4,-2.7; G8 5.4,-4.5; G9 5.4,-6.3; G10 5.4,-8.1; G11 5.4,-9.9
24LC32A-SOT23-5 = smd 0.6 x 1.1: 1 -0.95,-1.4; 2 0,-1.4; 3 0.95,-1.4; 4 0.95,1.4; 5 -0.95,1.4
TITAN-X1-GMS-3302 = smd 2 x 0.6: 1 -6.25,3; 2 -6.25,1.8; 3 -6.25,0.6; 4 -6.25,-0.6; 5 -6.25,-1.8; 6 -6.25,-3; 13 6.25,-3; 14 6.25,-1.8; 15 6.25,-0.6; 16 6.25,0.6; 17 6.25,1.8; 18 6.25,3 | smd 0.6 x 2: 7 -3.6,-6.25; 8 -2.4,-6.25; 9 -1.2,-6.25; 10 1.2,-6.25; 11 2.4,-6.25; 12 3.6,-6.25; 19 3.6,6.25; 20 2.4,6.25; 21 1.2,6.25; 22 -1.2,6.25; 23 -2.4,6.25; 24 -3.6,6.25 | hole 1.4: -0.45,0.25
AT45DB161E-SHD2B-T = smd 0.5 x 1: 1 -1.905,-2.875; 2 -0.635,-2.875; 3 0.635,-2.875; 4 1.905,-2.875; 5 1.905,2.875; 6 0.635,2.875; 7 -0.635,2.875; 8 -1.905,2.875
LSM6DSL = smd 0.575 x 0.35: 1 -1.1,0.75; 2 -1.1,0.25; 3 -1.1,-0.25; 4 -1.1,-0.75; 8 1.1,-0.75; 9 1.1,-0.25; 10 1.1,0.25; 11 1.1,0.75 | smd 0.35 x 0.575: 5 -0.5,-0.95; 6 0,-0.95; 7 0.5,-0.95; 12 0.5,0.95; 13 0,0.95; 14 -0.5,0.95
PAM2305AAB330 = smd 0.7 x 1: 1 -0.95,-1.2; 2 0,-1.2; 3 0.95,-1.2; 4 0.95,1.2; 5 -0.95,1.2
QFN20 = smd 0.75 x 0.3: 1 -2,1; 2 -2,0.5; 3 -2,0; 4 -2,-0.5; 5 -2,-1; 11 2,-1; 12 2,-0.5; 13 2,0; 14 2,0.5; 15 2,1 | smd 0.3 x 0.75: 6 -1,-2; 7 -0.5,-2; 8 0,-2; 9 0.5,-2; 10 1,-2; 16 1,2; 17 0.5,2; 18 0,2; 19 -0.5,2; 20 -1,2
FIDUCIAL_1MM = smd 1 x 1: 1 0,0
U.FL = smd 2.2 x 1.05: 1 0,1.375; 2 0,-1.375 | smd 0.8 x 1: 3 1.525,0
CRYSTAL-SMD-5X3.2-4PAD = smd 1.9 x 1.1: 1 -1.85,-1.15; 2 1.85,-1.15; 3 1.85,1.15; 4 -1.85,1.15

### Placement (x,y rotation side)
BAT+  2.98,41.72 90 top
BAT-  2.98,38.8 90 top
C1  28.19,60.85 90 top
C2  25.15,58.12 0 top
C3  23.3,21.6 270 top
C4  16.88,46.34 270 top
C5  31.37,30.23 270 top
C6  22.54,39.62 90 top
C7  12.95,30.1 180 top
C8  27.5,21.59 90 top
C9  38.67,32.89 0 top
C10  38.67,34.29 0 top
C11  13.59,43.5 0 top
C12  3.24,44.39 180 top
C13  6.67,38.04 180 top
CON1  59,22 90 bottom
F1  13.21,50.93 90 top
H1  70,5 0 top
H2  5,5 0 top
H3  70,62 0 top
H4  5,62 0 top
ICD3_HEADER  27.68,3.07 0 top
J1  59.87,1.62 270 top
J2  15,2 270 top
L1  29.78,60.79 90 top
L2  10.54,35.31 180 top
LED1  9.97,56.26 180 top
LED2  8.57,56.26 180 top
LED3  71,48.6 180 top
LED4  57,42 180 top
LED5  4.06,32.96 90 top
R1  26.15,63.82 0 top
R2  32.38,27.94 0 top
R3  32.38,26.54 0 top
R4  24.7,21.59 90 top
R5  26.1,21.59 90 top
R6  12.57,46.42 90 top
R7  13.97,46.42 270 top
R8  9.97,52.45 90 top
R9  8.57,52.45 90 top
R10  3.24,47.69 0 top
R11  3.24,46.29 0 top
R12  5.59,18.22 270 top
R13  44,34 180 top
R14  69,48.6 270 top
R15  55,42 270 top
R16  4,31.05 180 top
SJ1  20.64,61.48 0 top
SJ2  20.64,58.94 0 top
SJ3  44.01,19 180 top
SJ4  64.8,52.71 180 top
SJ5  64.8,55.37 180 top
SJ6  44.01,36 0 top
SJ7  19.19,22.17 180 top
SW1  1.91,16.78 270 top
TP1  38.99,2.22 0 top
TP2  38.99,5.21 0 top
TP3  36,2.22 0 top
U1  23.3,30.86 0 top
U2  60.75,25.25 0 top
U3  14.59,60.98 270 top
U4  50,57.98 90 top
U5  22.15,46.34 90 top
U6  25.02,60.98 0 top
U7  10.54,40.32 180 top
U8  8.57,46.29 180 top
U$1  1.25,1.25 0 top
U$2  73.75,1.25 0 top
U$3  1.25,65.75 0 top
U$4  73.75,65.75 0 top
X1  61,43.51 270 top
X2  70.36,43.43 270 top
Y1  35.18,33.59 270 top

### Tracks (layer width: path | path; a pad name or v marks a point on that pad's centre or on a via)
3.3V  (via drill 0.3, 0.61)
  Top 0.152: U6.5 24.52,58.12 C2.1
  Top 0.203: v33.02,29.15 42.23,29.15 43.35,30.27 R13.2 | LED5.A 4.81,34.6 5.52,35.31 L2.P$2
  Top 0.254: R3.2 R2.2 | C5.1 29,30.88 U1.28
  Top 0.305: U5.6 16.88,46.97 C4.1 | U1.17 C3.1 21.78,22.25 v21.78,22.23 | R5.2 26.1,23.05 v25.65,23.5 | U1.40 22.5,38.94 C6.1 23.8,38.97 v23.81,38.99 | v31.37,32.26 C5.1 | v33.02,29.15 33.02,27.95 R2.2 | R12.2 10.27,17.57 v13.08,20.38 13.02,20.45 13.02,26.29 14.39,27.66 U1.10 | v33.02,24.96 33.03,24.97 R3.2 | 24.5,56.77 C2.1 22.94,58.12 22.42,57.59 18.99,57.59 18.48,58.1 18.48,59.63 18.08,60.03 U3.4 | 24.5,54.8 24.5,56.77 | 24.5,56.77 29.15,56.77 31.37,58.99 31.37,61.02 31.03,61.37 L1.2 29.78,63.44 29.39,63.83 R1.2 | v9.21,37.72 v10.03,37.72 | SJ5.1 v67.5,55.37
  Top 0.61: U4.7 58.02,54.38 59.5,52.9 v59.5,49.97 59.5,48.9 58.93,48.32 28.64,48.32 24.5,52.47 | v15.68,46.99 15.7,46.97 16.88,46.97 | C4.1 16.88,50.4 18.86,52.39 24.42,52.39 24.5,52.47 | C2.1 24.5,54.8 24.5,52.47
  Bottom 0.305: v23.81,38.99 27.05,38.99 27.62,38.42 27.62,32.83 28.19,32.26 v31.37,32.26 31.37,30.8 v33.02,29.15 | v33.02,24.96 31.56,23.5 v25.65,23.5 25.65,22.86 25.02,22.23 v21.78,22.23 16.83,22.23 14.99,20.38 v13.08,20.38 9.21,24.26 v9.21,37.72 | v67.5,55.37 64.9,55.37 v59.5,49.97
  Bottom 0.356: ICD3_HEADER.2 25.14,17.15 21.78,20.51 v21.78,22.23
  Bottom 0.61: v10.03,37.72 13.46,37.72 15.68,39.94 v15.68,46.99
  pour Top (isolate 0.305): 7.56,40.39 7.56,34.61 8.13,34.04 9.91,34.04 10.48,34.61 10.48,39.94 10.03,40.39
  pour Bottom: 8.13,38.16 10.41,38.16 10.41,37.21 8.13,37.21
5V
  pour Top: 9.53,41.15 11.43,41.15 11.43,40.64 13.08,40.64 13.08,44.77 11.3,44.77 11.3,45.34 10.29,45.34 10.29,44.58 9.53,44.58
BOOT0  (via drill 0.3)
  Top 0.203: U1.15 21.7,27.45 20.83,28.32 20.83,29.4 21.53,30.1 24.19,30.1 v25.91,31.81 | v41.72,29.91 41.72,35.62 42.1,36.01 SJ6.1
  Bottom 0.203: v25.91,31.81 26.86,30.86 26.86,29.4 27.9,28.36 35.41,28.36 35.88,28.83 40.64,28.83 v41.72,29.91
BUTTON
  Top 0.203: U1.44 19.3,37.85 19.05,38.1 15.68,38.1 14.67,37.08 14.67,32.32 14.03,31.69 10.16,31.69 8.51,30.04 8.51,19.68 7.7,18.88 R12.1
  Top 0.305: SW1.SW1 R12.1
CS
  Top 0.203: U1.41 21.7,47.55 22.42,48.26 25,48.26 U5.4
GND  (via drill 0.35, 0.51)  (1 unrouted)
  Top 0.152: U2.F1 65.25,34.25 65.25,36.05
  Top 0.203: C2.2 25.72,58.2 25.72,59.05 25.46,59.05 | 25.46,59.05 25.52,59.11 U6.7 | 25.46,59.05 25.21,59.05 25.02,59.24 U6.6
  Top 0.61: U7.2 v10.54,42.8
  other vias: 50,3 24.73,33.54 19,41 28.16,42.88 14,41 12.54,33.23 11.27,27.51 2,36 3,36 3,35 2,35 10.31,30.11 28.35,62.88 27.25,58.25 23,56 26,56 23.46,59.01 18,62 11.71,60.91 67.25,40 62,40 60,40 47,33 48,16 53,12 61,12 66.94,12.51 73,12 71.02,20.91 70,27 69.75,31.64 59,40 58,40 57,40 56,40 63,40 47,18 33,15 33,16 32,16 32,15 27,15 27,16 5,15 28.16,45.63 21.91,50.38 17.66,53.63 17.66,56.88 3.91,54.88 23.91,15.38 15.66,8.13 15.66,10.88 15.66,13.88 15.66,16.88 15.66,19.38 15.41,24.38 13.66,19.38 13.66,16.88 13.66,13.88 13.66,10.88 13.66,8.38 14.16,23.13 16.91,25.88 18.16,24.13 16.91,23.13 20.66,26.88 22.66,27.13 21.91,23.38 27.91,18.38 25.41,18.38 45.41,9.88 62.16,8.88 63.94,12.44 60.66,10.38 39.25,36.25 39.25,31.25 60,41.02 62,41.02 63.78,43.56 62.51,45.59 59.46,45.59 58.19,43.56 58.98,41.02 63.02,41.02 64.03,41.02 64.03,42.03 58.19,42.03 58.44,45.59 58.19,44.57 63.78,44.57 67.25,41.02 67.25,42.03 67.25,43.05 67.25,44.06 67.25,45.08 68.52,45.59 72.08,45.59 68.52,41.02 71.57,41.02 70.81,40.25 73.35,42.03 73.35,43.05 73.35,44.06 73.35,45.08 67.25,40 69.75,31.64 70.95,21.92 70.97,10.98 66.75,10.22 64,10.22 59.79,11.56 61.58,8.05 59.26,10.06 45.98,15.65 47.62,14.16 50.52,12.32 51.65,2.81 45.53,11.34 33.06,17.27 31.87,17.14 32.94,13.79 31.87,13.98 27.59,17.62 26.55,17.93 27.13,16.76 26.94,14.11 23.72,16.71 13.66,10.88 13.66,8.38
  pour Top (isolate 0.203, rank 2): 0,67 75,67 75,0 0,0
  pour Bottom (isolate 0.203, rank 2): 75,67 0,67 0,0 75,0
MAIN_ANT  (1 unrouted)
  Top 0.762: X2.3 70.36,41.4 68,39.04
MCLR
  Top 0.203: 24.7,23.3 24.7,23.62 25.21,24.13 26.1,24.13 26.59,23.65 26.91,23.65 27.26,23.29 28.34,23.29 28.75,22.88 28.75,6.19 28.53,5.97 23.69,5.97 22.6,4.88 ICD3_HEADER.1 22.6,2.98
  Top 0.254: R4.2 24.7,23.3 24.11,23.3 U1.18
MISO  (via drill 0.3)
  Top 0.203: U1.33 30.16,34.86 30.54,35.24 30.54,43.75 v30.04,44.26 | v17.84,44.45 19.25,44.45 U5.8
  Bottom 0.203: v30.04,44.26 18.03,44.26 v17.84,44.45
MOSI
  Top 0.203: U1.36 25.7,39.48 26.29,40.07 26.29,44.01 25.84,44.45 25.04,44.45 U5.1
N$1
  Top 0.152: U6.2 22.73,61.23 22.73,61.48 SJ1.2
N$2
  Top 0.152: U6.3 22.73,60.73 22.73,58.94 SJ2.2
N$3
  Top 0.152: U6.12 25.52,63.83 R1.1
N$4
  Top 0.61: U4.8 59.17,55.58 62.04,52.7 SJ4.2
N$5
  Top 0.152: C1.1 26.15,60.2 U6.8
  Top 0.305: L1.1 C1.1
N$6
  Top 0.305: C8.1 R5.1 R4.1
N$7
  Top 0.152: U1.30 30.56,32.46 31.37,33.27 35.18,33.27 36.33,32.12 Y1.3 36.33,32.9 36.58,33.15 36.96,33.15 37.21,32.89 C9.1
N$8
  Top 0.152: U1.31 30.93,33.26 31.24,33.58 33.66,33.58 34.03,33.95 Y1.1 34.03,35.12 35.05,34.1 37.21,34.1 37.4,34.29 C10.1
N$9
  Top 0.305: U1.7 13.8,30.06 C7.1
N$10
  Top 0.279: U8.2 12.57,45.79 R6.1 R7.2
N$12
  Top 0.61: U2.E2 U2.E1
  Top 0.813: U2.E1 U2.E0 62.55,35.68 62.55,35.69
  Top 0.838: 62.55,35.69 62.55,35.75
  Top 0.864: 62.55,35.75 62.55,35.81
  Top 0.889: 62.55,35.81 62.55,35.88
  Top 0.914: 62.55,35.88 62.55,35.94
  Top 0.94: 62.55,35.94 62.55,36.01
  Top 0.965: 62.55,36.01 62.55,36.07
  Top 0.991: 62.55,36.07 62.55,36.13
  Top 1.016: 62.55,36.13 62.55,37.85
N$13
  Top 0.152: LED1.C R8.2
N$14
  Top 0.152: LED2.C R9.2
N$15
  Top 0.152: R8.1 9.97,51.05 9.07,50.16 U8.7
N$16
  Top 0.152: R9.1 U8.8
N$17
  Top 0.61: U7.5 11.49,37.4 12.04,36.85 L2.P$1
N$19
  Top 0.279: U8.12 5.21,46.79 5.21,47.69 R10.2
N$20
  Top 0.279: U8.13 R11.2
N$22
  Top 0.279: R13.1 44.65,36.01 SJ6.2
N$23  (via drill 0.3)
  Top 0.152: v51.88,23.5 51.94,23.43 58.07,23.43 U2.C7
  Bottom 0.152: CON1.C1 58.16,17.28 57.91,17.53 57.91,18.86 57.47,19.3 53.28,19.3 51.88,20.7 v51.88,23.5
N$24
  Top 0.279: U8.5 11.03,47.29 11.49,47.75 11.49,48.9 12.1,49.51 F1.1
N$25  (via drill 0.3)
  Top 0.152: v52.51,21.21 52.9,21.59 56.19,21.59 U2.B7
  Bottom 0.152: CON1.C2 53.9,19.82 v52.51,21.21
N$26  (via drill 0.3)
  Top 0.152: v52.58,22.54 U2.A7
  Bottom 0.152: CON1.C3 52.76,22.36 v52.58,22.54
N$27  (via drill 0.3)
  Top 0.152: v52.7,24.32 55.32,24.32 U2.A6
  Bottom 0.152: CON1.C7 53.4,23.63 v52.7,24.32
N$28
  Top 0.279: R14.1 71,49.25 LED3.A
N$30
  Top 0.279: R15.1 57,42.65 LED4.A
N$35
  Top 0.203: LED5.C 3.31,31.09 R16.2
N$36
  Top 0.61: TP3.TP 36.01,18 39,21 45.5,21 46.5,20
PGC
  Top 0.203: U1.22 27.3,24.26 27.56,24 28.64,24 29.46,23.18 29.46,6.26 29.76,5.97 32,5.97 32.76,5.21 ICD3_HEADER.5
PGD
  Top 0.203: U1.21 26.5,24.23 26.73,24 27.06,24 27.41,23.65 28.49,23.65 29.11,23.03 29.11,6.12 30.22,5.01 30.22,2.98 | 30.22,2.98 30.23,2.08 | 30.22,2.98 ICD3_HEADER.4
PIC_CTS  (via drill 0.3)
  Top 0.203: v21.21,33.02 20.93,33.3 20.64,33.3 19.88,34.06 U1.2 | U2.A1 53.78,31.78 v52.51,31.78
  Bottom 0.203: v21.21,33.02 21.67,33.02 24.78,29.91 24.78,29.17 26.3,27.65 43.9,27.65 48.28,32.03 52.26,32.03 v52.51,31.78
PIC_RTS  (via drill 0.3)
  Top 0.203: v20.89,33.91 19.94,34.86 U1.1 | U2.B1 v56.26,32.46 v56.26,32.45
  Bottom 0.203: v20.89,33.91 21.28,33.91 25.13,30.06 25.13,29.31 26.44,28 43.75,28 48.13,32.38 56.2,32.38 v56.26,32.45
PIC_RX  (via drill 0.3)
  Top 0.203: v21.6,32.19 20.96,32.19 20.7,32.45 17.62,32.45 U1.4 | U2.C1 v58.05,32.45 v58.04,32.45
  Bottom 0.203: v21.6,32.19 21.98,32.19 24.42,29.74 24.42,29.02 26.15,27.29 44.06,27.29 48.44,31.67 51.76,31.67 52.26,31.17 52.77,31.17 53.12,31.53 53.62,32.03 55.82,32.03 56.01,31.84 57.43,31.84 v58.04,32.45
PIC_TX  (via drill 0.3)
  Top 0.203: v21.97,31.34 21.73,31.58 21.34,31.58 21.26,31.66 U1.5 | U2.C2 58.07,30.67 v58.04,30.67
  Bottom 0.203: v21.97,31.34 22.06,31.24 22.42,31.24 24.07,29.6 24.07,28.87 26,26.94 44.2,26.94 48.59,31.32 51.61,31.32 52.12,30.82 52.91,30.82 53.48,31.38 53.77,31.67 55.67,31.67 55.86,31.49 57.22,31.49 v58.04,30.67
RESET  (via drill 0.3)
  Top 0.203: U5.3 23.67,46.97 23.37,46.67 23.37,42.04 v23.56,41.85 | v26.1,29.21 26.15,29.26 U1.26
  Bottom 0.203: v23.56,41.85 23.56,40.89 22.7,40.02 22.7,33 25.49,30.21 25.49,29.85 26.1,29.24 v26.1,29.21
RX0  (via drill 0.3)
  Top 0.203: U1.38 24.11,37.82 24.64,38.35 24.64,40.2 v25.15,40.7 | v31.94,49.47 31.34,50.06 31.34,55.03 37.55,61.24 41.5,61.24 42.37,60.38 U4.20
  Bottom 0.203: v25.15,40.7 26.07,40.7 26.8,41.43 29.1,41.43 31.34,43.67 31.34,48.87 v31.94,49.47
SCK  (via drill 0.3)
  Top 0.203: U5.2 24.18,45.7 23.81,45.34 23.81,42.86 v24.51,42.16 | v26.1,30.1 26.14,30.06 U1.27
  Bottom 0.203: v24.51,42.16 24.51,41.34 23.05,39.88 23.05,33.15 v26.1,30.1
SCL  (via drill 0.3)
  Top 0.203: U1.24 24.28,27.66 v22.92,29.02 | v15.05,52.13 15.3,52.13 15.3,55.05 10.73,59.63 10.73,61.34 11.32,61.93 U3.1 13.98,61.93 14.31,62.26 14.31,63.2 14.84,63.73 24.28,63.73 25.02,62.99 U6.13
  Top 0.254: U1.24 30.48,27.66 30.48,27.94 R2.1
  Bottom 0.203: v15.05,52.13 15.33,51.85 15.33,51.35 16.66,50.02 16.66,33.83 21.43,29.06 21.43,28.7 21.78,28.35 22.29,28.35 22.64,28.7 22.64,28.74 v22.92,29.02
SDA  (via drill 0.3)
  Top 0.203: U1.23 24.58,26.86 23.03,28.41 22.67,28.41 22.12,28.96 v22.04,28.96 | v15.91,52.13 15.66,52.13 15.66,55.2 12.04,58.82 12.04,59.79 12.27,60.03 U3.3 14.37,60.03 14.67,60.33 14.67,63.06 14.99,63.37 24.13,63.37 24.51,62.99 U6.14
  Top 0.254: U1.23 30.48,26.86 30.48,26.54 R3.1
  Bottom 0.203: v15.91,52.13 15.68,52.13 15.68,51.5 17.02,50.16 17.02,33.97 v22.04,28.96
SIM_N
  Top 0.152: J1.D- 59.22,5.14 59.41,5.33 59.41,8.38 62.8,11.77 68.96,11.77 69.44,12.26 69.44,23.81 68.14,25.12 63.25,25.12 62.55,24.43 U2.E6
SIM_P
  Top 0.152: J1.D+ 59.87,5.18 59.72,5.33 59.72,8.26 62.93,11.47 69.09,11.47 69.75,12.13 69.75,23.94 68.26,25.43 63.25,25.43 62.55,26.12 U2.E5
TELIT_RESET  (via drill 0.3)
  Top 0.203: SJ3.2 39.63,19 v39.62,18.99 | v21.84,34.42 21.25,34.42 21.14,34.52 20.98,34.52 20.11,35.4 U1.43
  Bottom 0.203: v39.62,18.99 35.05,23.56 35.05,25.59 34.06,26.58 25.85,26.58 23.71,28.72 23.71,29.45 22.43,30.73 21.71,30.73 20.28,32.16 20.28,34.16 20.64,34.52 21.14,34.52 21.25,34.42 v21.84,34.42
TELIT_WAKEUP
  Top 0.61: U4.12 58.69,61.58 60.33,59.94 60.33,57.02 61.98,55.37 SJ5.2
TESTMODE
  Top 0.203: U1.14 20.9,23.89 20.57,23.56 20.13,23.56 19.94,23.37 SJ7.1
TX0  (via drill 0.3)
  Top 0.203: U1.37 24.9,37.99 25.21,38.29 25.21,39.69 25.78,40.26 25.78,41.53 v25.53,41.78 | v30.99,49.4 30.99,55.18 37.4,61.59 43.73,61.59 U4.19
  Bottom 0.203: v25.53,41.78 28.96,41.78 30.99,43.81 v30.99,49.4
USB_N
  Top 0.152: J2.D- 14.34,5.41 14.52,5.59 14.52,5.98 arc90 14.36,6.14 14.28,6.14 arc-90 14.13,6.29 14.13,6.93 arc-90 14.28,7.09 14.36,7.09 arc90 14.52,7.24 14.52,22.16 19.34,26.99 19.34,28.32 18.99,28.68 18.58,28.68 18.35,28.45 17.62,28.45 U1.9
USB_P
  Top 0.152: J2.D+ 14.99,5.42 14.82,5.59 14.82,22.04 19.65,26.86 19.65,28.45 19.11,28.98 18.61,28.98 18.33,29.26 U1.8
V_USB  (via drill 0.3, 0.51)
  Top 0.254: 8.57,43.37 8.07,43.37 U8.17 | U8.19 9.07,43.37 8.57,43.37 | U8.18 8.57,43.37
  Top 0.279: U8.4 v11.49,46.79 v11.49,46.8 | U8.3 11.49,46.29 v11.49,46.8 | v11.49,46.8 11.76,47.07 R6.2 | U8.9 8.07,50.04 v7.87,50.04
  Top 0.305: v11.24,57.02 11.23,57.01 LED1.A LED2.A 7.93,57.01 7.3,56.39 7.3,50.61 v7.87,50.04
  Bottom 0.279: v7.87,50.04 10.54,50.04 11.49,49.09 v11.49,46.8
  Bottom 0.508: v11.49,46.8 11.49,45.78 7.94,42.23 v7.81,42.23 | v6.86,42.23 6.29,41.66 6.29,24.7 12.45,18.54 v12.45,7.49 v12.45,6.35
  Bottom 0.61: v7.81,42.23 v6.86,42.23
  pour Top (isolate 0.203): 8,44.64 8,43.18 7.68,42.86 6.54,42.86 6.54,41.66 8.76,41.66 8.76,42.74 9.14,42.74 9.14,44.64
  pour Top (isolate 0.203): 13.72,3.43 13.72,5.84 13.27,6.29 13.27,7.62 12.76,8.13 12.06,8.13 11.56,7.62 11.56,6.48 13.14,4.83 13.14,3.43
VBAT  (via drill 0.61)
  Top 0.254: 5.84,45.28 5.84,44.83 6.57,44.83 | 5.84,45.28 5.84,45.79 U8.14 U8.15 | U8.15 6.57,45.28 5.84,45.28 | 6.57,44.83 U8.15 | 6.57,44.83 6.57,44.29 U8.16 7.57,43.24 4.89,43.24 4.09,43.24 C12.1
  Top 0.305: SJ4.1 65.56,45.69 65.79,45.47 v65.79,43.05
  Top 0.61: v65.79,41.66 66,41.44 66,39.62 65.28,39.62 | 65.28,39.62 65,39.35 | 64,39.36 64.26,39.62 65.28,39.62
  Top 0.813: BAT+.TP 4.89,43.24
  Bottom 0.61: v5.65,44.01 5.65,51.37 9.53,55.24 20.77,55.24 24.64,51.37 33.78,51.37 38.61,46.55 63.25,46.55 65.79,44.01 v65.79,43.05 v65.79,41.66
  pour Top (isolate 0.305): 6.99,45.85 6.99,44.77 7.56,44.77 7.56,43.24 5.46,43.24 5.14,42.93 5.14,42.35 4.51,42.35 4,42.86 4,45.4 5.08,45.4 5.08,45.85
  pour Top: 66.29,39.88 66.29,43.69 65.28,43.69 65.28,39.88
WP
  Top 0.203: U1.42 20.9,47.55 20.19,48.26 19.29,48.26 U5.5

### Text on the board
tPlace: CELL | GPS | GPS TRACKER / CELL VERSION / DEV BOARD / REV1.0 | VDD_EXT | MDM_LOG_TX
Measures: Veronica is / the BEST! | NETLIGHT | STATUS | BOOT_CFG